# EAGLE design dmpcb2 (EAGLE 9.5.2)
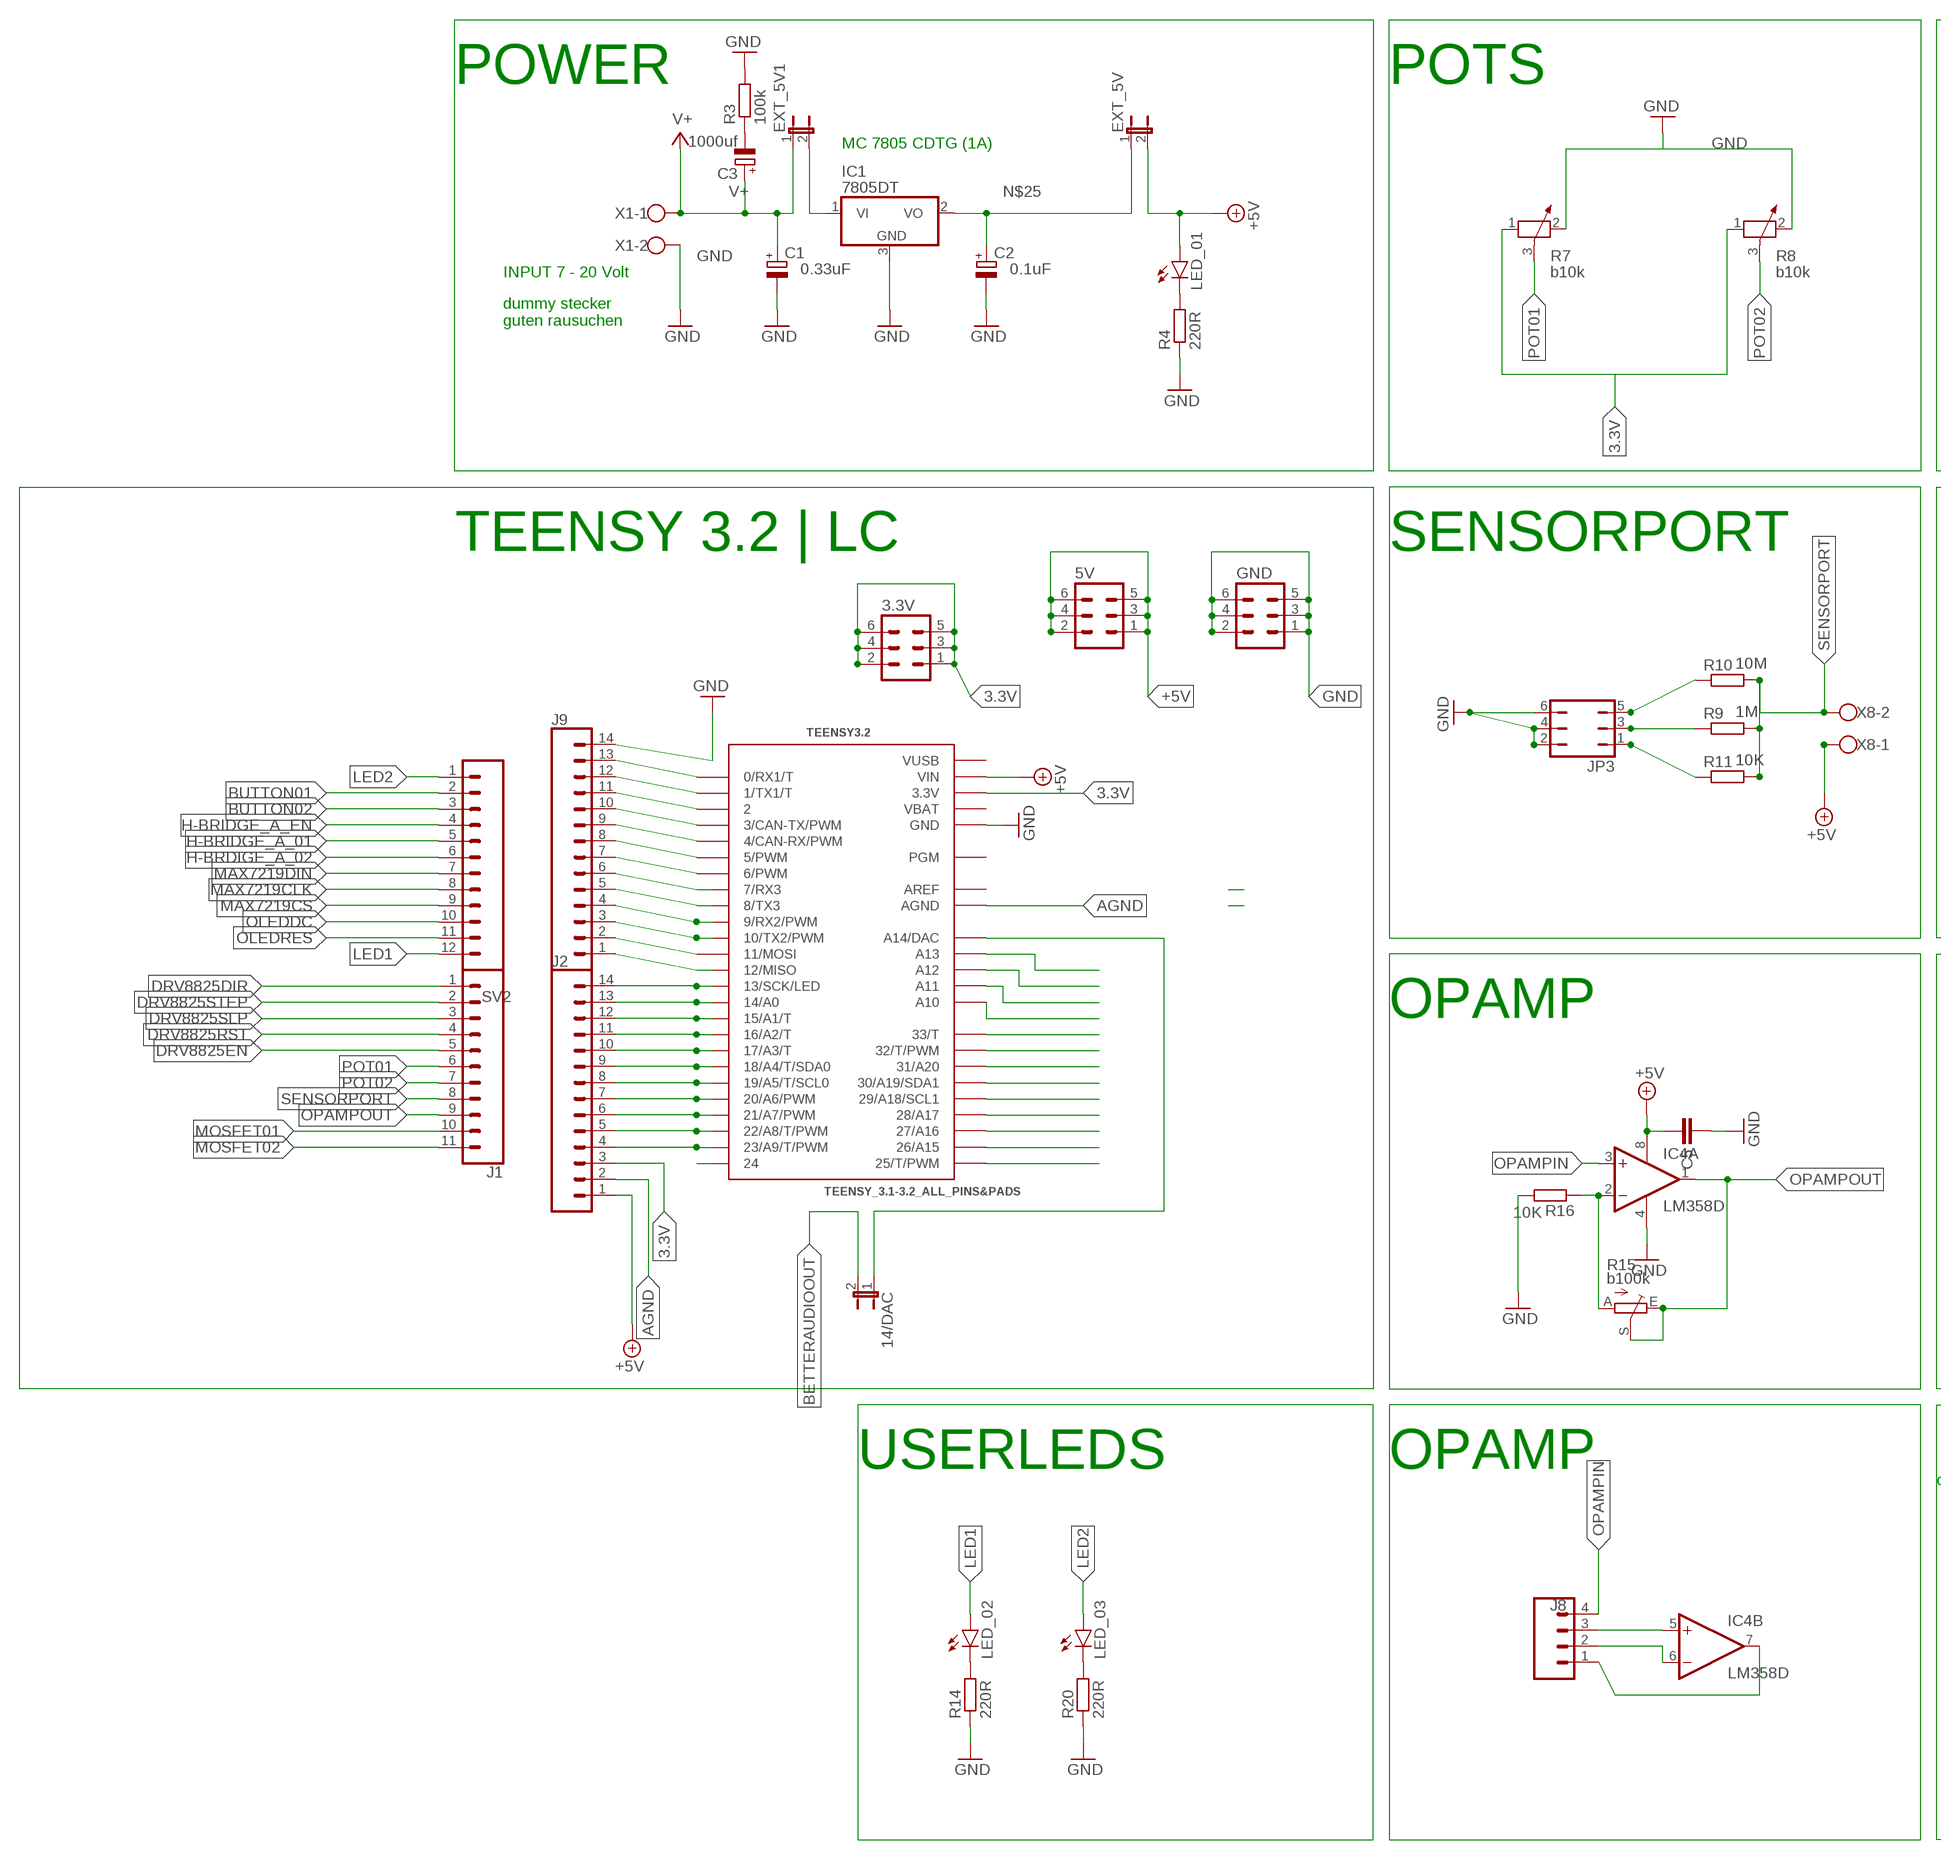
[diagram p0: schematic, sheet 1, part 1 of 2]
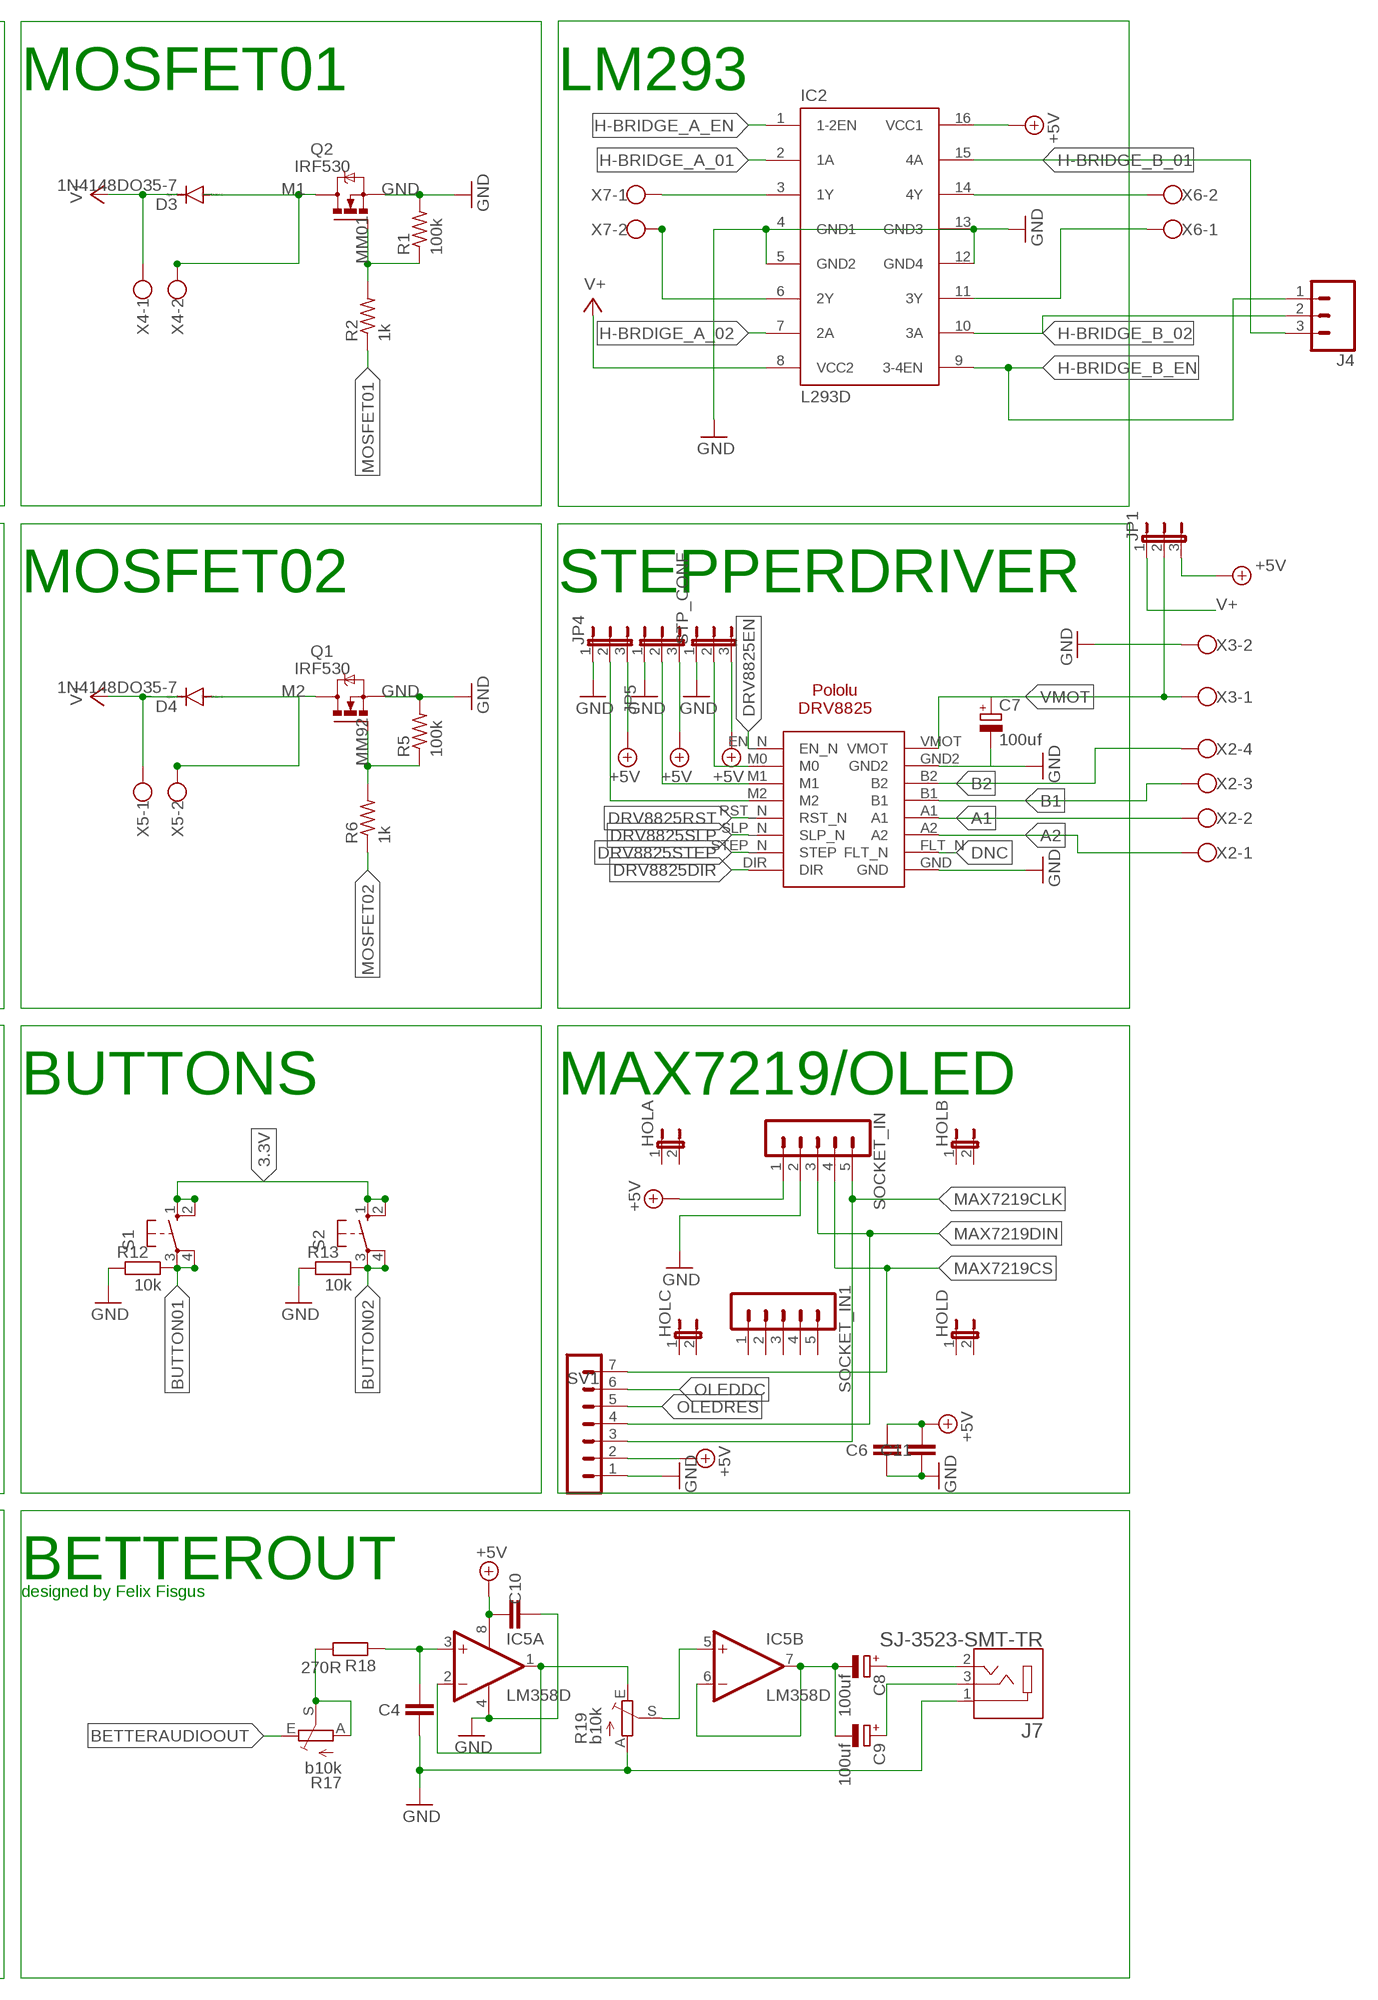
[diagram p1: schematic, sheet 1, part 2 of 2]

## Parts
3.3V  MA03-2  [MA03-2]
5V  MA03-2  [MA03-2]
14/DAC  JP1E  [JP1]
C1  0.33uF  CPOL-EUSANYO_A'  [SANYO-OSCON_A']
C2  0.1uF  CPOL-EUSANYO_A'  [SANYO-OSCON_A']
C3  1000uf  CPOL-EUE3.5-8  [E3,5-8]
C4  100nf  C-EUC0805  [C0805]
C5  100nf  C-EUC0805  [C0805]
C6  100nf  C-EUC0805  [C0805]
C7  100uf  CPOL-EUE5-5  [E5-5]
C8  100uf  CPOL-EUE5-5  [E5-5]
C9  100uf  CPOL-EUE5-5  [E5-5]
C10  100nf  C-EUC0805  [C0805]
C11  10uf  C-EUC0805  [C0805]
D3  1N4148DO35-7  [DO35-7]
D4  1N4148DO35-7  [DO35-7]
DRV8825  POLOLU-DRV8825  [POLOLU-DRV8825]
EXT_5V  JP1E  [JP1]
EXT_5V1  JP1E  [JP1]
GND  MA03-2  [MA03-2]
HOLA  JP1E  [JP1]
HOLB  JP1E  [JP1]
HOLC  JP1E  [JP1]
HOLD  JP1E  [JP1]
IC1  7805DT  [TO252]
IC2  L293D  [DIL16]
IC4  LM358D  [SO08]
IC5  LM358D  [SO08]
J1  CONN_11  [1X11]
J2  CONN_14  [1X14]
J4  CONN_03LOCK_LONGPADS  [1X03_LOCK_LONGPADS]
J7  SJ-3523-SMT-TR  [CUI_SJ-3523-SMT-TR]
J8  CONN_04  [1X04]
J9  CONN_14  [1X14]
JP1  JP2E  [JP2]
JP3  JP3Q  [JP3Q]
JP4  JP2E  [JP2]
JP5  JP2E  [JP2]
LED_01  LEDSML0805  [SML0805]
LED_02  LEDSML0805  [SML0805]
LED_03  LEDSML0805  [SML0805]
Q1  IRF530  [TO220BV]
Q2  IRF530  [TO220BV]
R1  100k  R-US_R0805  [R0805]
R2  1k  R-US_R0805  [R0805]
R3  100k  R-EU_R0805  [R0805]
R4  220R  R-EU_R0805  [R0805]
R5  100k  R-US_R0805  [R0805]
R6  1k  R-US_R0805  [R0805]
R7  b10k  POTENTIOMETER_PT-10  [PT-10]
R8  b10k  POTENTIOMETER_PT-10  [PT-10]
R9  1M  R-EU_M0805  [M0805]
R10  10M  R-EU_M0805  [M0805]
R11  10K  R-EU_M0805  [M0805]
R12  10k  R-EU_M0805  [M0805]
R13  10k  R-EU_M0805  [M0805]
R14  220R  R-EU_R0805  [R0805]
R15  b100k  TRIM_EU-RJ9W  [RJ9W]
R16  10K  R-EU_M0805  [M0805]
R17  b10k  TRIM_EU-RJ9W  [RJ9W]
R18  270R  R-EU_M0805  [M0805]
R19  b10k  TRIM_EU-RJ9W  [RJ9W]
R20  220R  R-EU_R0805  [R0805]
S1  10-XX  [B3F-10XX]
S2  10-XX  [B3F-10XX]
SOCKET_IN  MA05-1  [MA05-1]
SOCKET_IN1  MA05-1  [MA05-1]
STP_CONF  JP2E  [JP2]
SV1  MA07-1  [MA07-1]
SV2  CONN_12  [1X12]
TEENSY3.2  TEENSY_3.1-3.2_ALL_PINS&PADS  [TEENSY_3.0-3.2_ALL_PINS_&_PADS]
X1  W237-102  [W237-102]
X2  W237-4  [W237-4]
X3  W237-102  [W237-102]
X4  W237-102  [W237-102]
X5  W237-102  [W237-102]
X6  W237-102  [W237-102]
X7  W237-102  [W237-102]
X8  W237-102  [W237-102]

## Nets
3.3V: 3.3V.1 3.3V.2 3.3V.3 3.3V.4 3.3V.5 3.3V.6 J2.3 R7.1 R8.1 S1.1(S) S1.2(S1) S2.1(S) S2.2(S1) TEENSY3.2.3.3V TEENSY3.2.3.3V1(3.3V) TEENSY3.2.3.3V2(3.3V)
+5V: 5V.1 5V.2 5V.3 5V.4 5V.5 5V.6 C5.1 C6.1 C10.2 C11.1 EXT_5V.2 IC2.16(VCC1) IC4.8(P:V+) IC5.8(P:V+) J2.1 JP1.3 JP4.3 JP5.3 LED_01.A SOCKET_IN.1 STP_CONF.3 SV1.2 TEENSY3.2.VIN X8.1
A1: DRV8825.A1 X2.2
A2: DRV8825.A2 X2.1
AGND: J2.2 TEENSY3.2.AGND
B1: DRV8825.B1 X2.3
B2: DRV8825.B2 X2.4
BETTERAUDIOOUT: 14/DAC.2 R17.E
BUTTON01: R12.2 S1.3(P) S1.4(P1) SV2.2
BUTTON02: R13.2 S2.3(P) S2.4(P1) SV2.3
DNC: DRV8825.FLT_N
DRV8825DIR: DRV8825.DIR J1.1
DRV8825EN: DRV8825.EN_N J1.5
DRV8825RST: DRV8825.RST_N J1.4
DRV8825SLP: DRV8825.SLP_N J1.3
DRV8825STEP: DRV8825.STEP_N(STEP) J1.2
GND: C1.- C2.- C4.2 C5.2 C6.2 C7.- C10.1 C11.2 DRV8825.GND DRV8825.GND2 GND.1 GND.2 GND.3 GND.4 GND.5 GND.6 IC1.3(GND) IC2.4(GND1) IC2.5(GND2) IC2.12(GND4) IC2.13(GND3) IC4.4(P:V-) IC5.4(P:V-) J7.1 J9.14 JP3.2 JP3.4 JP3.6 JP4.1 JP5.1 Q1.S Q2.S R1.2 R3.2 R4.1 R5.2 R7.2 R8.2 R12.1 R13.1 R14.1 R16.2 R19.A R20.1 SOCKET_IN.2 STP_CONF.1 SV1.1 TEENSY3.2.GND TEENSY3.2.GND1(GND) TEENSY3.2.GND2(GND) X1.2 X3.2
H-BRDIGE_A_02: IC2.7(2A) SV2.6
H-BRIDGE_A_01: IC2.2(1A) SV2.5
H-BRIDGE_A_EN: IC2.1(1-2EN) SV2.4
H-BRIDGE_B_01: IC2.15(4A) J4.3
H-BRIDGE_B_02: IC2.10(3A) J4.2
H-BRIDGE_B_EN: IC2.9(3-4EN) J4.1
LED1: LED_02.A SV2.12
LED2: LED_03.A SV2.1
M1: D3.A Q2.D X4.2
M2: D4.A Q1.D X5.2
MAX7219CLK: SOCKET_IN.5 SV1.3 SV2.8
MAX7219CS: SOCKET_IN.4 SV1.7 SV2.9
MAX7219DIN: SOCKET_IN.3 SV1.4 SV2.7
MM01: Q2.G R1.1 R2.2
MM92: Q1.G R5.1 R6.2
MOSFET01: J1.10 R2.1
MOSFET02: J1.11 R6.1
N$5: IC2.3(1Y) X7.1
N$6: IC2.6(2Y) X7.2
N$8: C3.- R3.1
N$9: LED_01.C R4.2
N$11: IC2.14(4Y) X6.2
N$12: IC2.11(3Y) X6.1
N$16: JP3.5 R10.1
N$17: JP3.3 R9.1
N$18: JP3.1 R11.1
N$19: EXT_5V1.2 IC1.1(VI)
N$20: IC4.5(B:+IN) J8.3
N$22: TEENSY3.2.24
N$23: J2.4 TEENSY3.2.23/A9(23/A9/T/PWM)
N$25: C2.+ EXT_5V.1 IC1.2(VO)
N$26: J2.5 TEENSY3.2.22/A8(22/A8/T/PWM)
N$27: J2.6 TEENSY3.2.21/A7(21/A7/PWM)
N$28: J2.7 TEENSY3.2.20/A6(20/A6/PWM)
N$29: J2.8 TEENSY3.2.19/A5(19/A5/T/SCL0)
N$30: J2.9 TEENSY3.2.18/A4(18/A4/T/SDA0)
N$31: J2.10 TEENSY3.2.17/A3(17/A3/T)
N$32: J2.11 TEENSY3.2.16/A2(16/A2/T)
N$33: J2.12 TEENSY3.2.15/A1(15/A1/T)
N$34: J2.13 TEENSY3.2.14/A0
N$35: J2.14 TEENSY3.2.13(13/SCK/LED)
N$36: J9.1 TEENSY3.2.12(12/MISO)
N$37: J9.2 TEENSY3.2.11(11/MOSI)
N$38: J9.3 TEENSY3.2.10(10/TX2/PWM)
N$39: J9.4 TEENSY3.2.9(9/RX2/PWM)
N$40: J9.5 TEENSY3.2.8(8/TX3)
N$41: J9.6 TEENSY3.2.7(7/RX3)
N$42: TEENSY3.2.25(25/T/PWM)
N$43: TEENSY3.2.26(26/A15)
N$44: TEENSY3.2.27(27/A16)
N$45: TEENSY3.2.28(28/A17)
N$46: TEENSY3.2.29(29/A18/SCL1)
N$47: TEENSY3.2.30(30/A19/SDA1)
N$48: TEENSY3.2.31(31/A20)
N$49: TEENSY3.2.32(32/T/PWM)
N$50: TEENSY3.2.33(33/T)
N$51: TEENSY3.2.A10
N$52: TEENSY3.2.A11
N$53: TEENSY3.2.A12
N$54: TEENSY3.2.A13
N$55: 14/DAC.1 TEENSY3.2.RESET/DAC(A14/DAC)
N$57: DRV8825.M2 JP4.2
N$58: DRV8825.M1 JP5.2
N$59: DRV8825.M0 STP_CONF.2
N$61: J9.12 TEENSY3.2.1(1/TX1/T)
N$62: J9.13 TEENSY3.2.0(0/RX1/T)
N$63: IC4.2(A:-IN) R15.A R16.1
N$64: LED_02.C R14.2
N$66: C8.+ J7.2
N$67: R17.A R17.S R18.2
N$68: C4.1 IC5.3(A:+IN) R18.1
N$69: IC5.1(A:OUT) IC5.2(A:-IN) R19.E
N$70: IC4.6(B:-IN) J8.2
N$71: IC5.5(B:+IN) R19.S
N$72: C8.- C9.- IC5.6(B:-IN) IC5.7(B:OUT)
N$73: C9.+ J7.3
N$75: IC4.7(B:OUT) J8.1
N$76: LED_03.C R20.2
OLEDDC: SV1.6 SV2.10
OLEDRES: SV1.5 SV2.11
OPAMPIN: IC4.3(A:+IN) J8.4
OPAMPOUT: IC4.1(A:OUT) J1.9 R15.E R15.S
PIN2: J9.11 TEENSY3.2.2
PIN3: J9.10 TEENSY3.2.3(3/CAN-TX/PWM)
PIN4: J9.9 TEENSY3.2.4(4/CAN-RX/PWM)
PIN5: J9.8 TEENSY3.2.5(5/PWM)
PIN6: J9.7 TEENSY3.2.6(6/PWM)
POT01: J1.6 R7.3
POT02: J1.7 R8.3
SENSORPORT: J1.8 R9.2 R10.2 R11.2 X8.2
V+: C1.+ C3.+ D3.C D4.C EXT_5V1.1 IC2.8(VCC2) JP1.1 X1.1 X4.1 X5.1
VMOT: C7.+ DRV8825.VMOT JP1.2 X3.1
Unconnected: HOLA.1 HOLA.2 HOLB.1 HOLB.2 HOLC.1 HOLC.2 HOLD.1 HOLD.2 SOCKET_IN1.1 SOCKET_IN1.2 SOCKET_IN1.3 SOCKET_IN1.4 SOCKET_IN1.5 TEENSY3.2.PGM

## Notes on the sheet
- POWER | POTS | MOSFET01 | LM293
- MC 7805 CDTG (1A)
- INPUT 7 - 20 Volt
- dummy stecker
  guten rausuchen
- TEENSY 3.2 | LC | SENSORPORT | MOSFET02 | STEPPERDRIVER
- OPAMP | BUTTONS | MAX7219/OLED
- USERLEDS | OPAMP | BETTEROUT
- designed by Felix Fisgus

## Power pins joined to a net without a drawn wire
AREF: TEENSY3.2.AREF
VBAT: TEENSY3.2.VBAT
VUSB: TEENSY3.2.VUSB

## Library data of the parts
3.3V 5V GND = con-lstb:MA03-2: PIN HEADER; OC_FARNELL: unknown; OC_NEWARK: unknown
14/DAC EXT_5V EXT_5V1 HOLA HOLB HOLC HOLD = jumper:JP1E: JUMPER
C1-C3 C7-C9 = rcl:CPOL-EU: POLARIZED CAPACITOR, European symbol; SPICEPREFIX: C
C4-C6 C10 C11 = rcl:C-EU: CAPACITOR, European symbol; SPICEPREFIX: C
D3 D4 = diode:1N4148: DIODE high speed (Philips)
DRV8825 = alvarop-lib:POLOLU-DRV8825
IC1 = linear:78*: Positive VOLTAGE REGULATOR Source: http://cache.national.com/ds/LM/LM78L05.pdf http://www.fairchildsemi.com/ds/LM/LM7805.pdf
IC2 = st-microelectronics:L293D: PUSH-PULL 4 CHANNEL DRIVER; MPN: L293D; OC_FARNELL: 9589619; OC_NEWARK: 56P8249
IC4 IC5 = linear:LM358: OP AMP also LM158; LM258; LM2904 Source: http://cache.national.com/ds/LM/LM158.pdf
J1 = SparkFun-Connectors:CONN_11: Multi connection point. Often used as Generic Header-pin footprint for 0.1 inch spaced/style header connections On any of the 0.1 inch spaced packages, you can populate with these: Break Away Headers - Straight <https://www.sparkfun.com/products/116> (PRT-00116) Break Away Male Headers - Right Angle <https://www.sparkfun.com/products/553> (PRT-00553) Female Headers <https://www.sparkfun.com/products/115> (PRT-00115) Break Away Headers - Machine Pin <https://www.sparkfun.com/products/117> (PRT-00117) Break Away Female Headers - Swiss Machine Pin <https://www.sparkfun.com/products/743> (PRT-00743) For SCREWTERMINALS and SPRING TERMINALS visit here: Screw Terimnals on SparkFun.com <https://www.sparkfun.com/search/results?term=Screw+Terminals> (5mm/3.5mm/2.54mm spacing) This device is also useful as a general connection point to wire up your design to another part of your project. Our various solder wires solder well into these plated through hole pads. Hook-Up Wire - Assortment (Stranded, 22 AWG) <https://www.sparkfun.com/products/11375> (PRT-11375) Hook-Up Wire - Assortment (Solid Core, 22 AWG) <https://www.sparkfun.com/products/11367> (PRT-11367) View the entire wire category on our website here <https://www.sparkfun.com/categories/141>
J2 J9 = SparkFun-Connectors:CONN_14: Multi connection point. Often used as Generic Header-pin footprint for 0.1 inch spaced/style header connections On any of the 0.1 inch spaced packages, you can populate with these: Break Away Headers - Straight <https://www.sparkfun.com/products/116> (PRT-00116) Break Away Male Headers - Right Angle <https://www.sparkfun.com/products/553> (PRT-00553) Female Headers <https://www.sparkfun.com/products/115> (PRT-00115) Break Away Headers - Machine Pin <https://www.sparkfun.com/products/117> (PRT-00117) Break Away Female Headers - Swiss Machine Pin <https://www.sparkfun.com/products/743> (PRT-00743) For SCREWTERMINALS and SPRING TERMINALS visit here: Screw Terimnals on SparkFun.com <https://www.sparkfun.com/search/results?term=Screw+Terminals> (5mm/3.5mm/2.54mm spacing) This device is also useful as a general connection point to wire up your design to another part of your project. Our various solder wires solder well into these plated through hole pads. Hook-Up Wire - Assortment (Stranded, 22 AWG) <https://www.sparkfun.com/products/11375> (PRT-11375) Hook-Up Wire - Assortment (Solid Core, 22 AWG) <https://www.sparkfun.com/products/11367> (PRT-11367) View the entire wire category on our website here <https://www.sparkfun.com/categories/141> Special notes: Molex polarized connector foot print use with SKU : PRT-08231 with associated crimp pins and housings. 1MM SMD Version SKU: PRT-10208 NOTES ON THE VARIANTS LOCK and LOCK_LONGPADS... This footprint was designed to help hold the alignment of a through-hole component (i.e. 6-pin header) while soldering it into place. You may notice that each hole has been shifted either up or down by 0.005 of an inch from it's more standard position (which is a perfectly straight line). This slight alteration caused the pins (the squares in the middle) to touch the edges of the holes. Because they are alternating, it causes a "brace" to hold the component in place. 0.005 has proven to be the perfect amount of "off-center" position when using our standard breakaway headers. Although looks a little odd when you look at the bare footprint, once you have a header in there, the alteration is very hard to notice. Also,if you push a header all the way into place, it is covered up entirely on the bottom side.
J4 = SparkFun-Connectors:CONN_03: Multi connection point. Often used as Generic Header-pin footprint for 0.1 inch spaced/style header connections On any of the 0.1 inch spaced packages, you can populate with these: Break Away Headers - Straight <https://www.sparkfun.com/products/116> (PRT-00116) Break Away Male Headers - Right Angle <https://www.sparkfun.com/products/553> (PRT-00553) Female Headers <https://www.sparkfun.com/products/115> (PRT-00115) Break Away Headers - Machine Pin <https://www.sparkfun.com/products/117> (PRT-00117) Break Away Female Headers - Swiss Machine Pin <https://www.sparkfun.com/products/743> (PRT-00743) Stackable Header - 3 Pin (Female, 0.1") <https://www.sparkfun.com/products/13875> (PRT-13875) For SCREWTERMINALS and SPRING TERMINALS visit here: Screw Terimnals on SparkFun.com <https://www.sparkfun.com/search/results?term=Screw+Terminals> (5mm/3.5mm/2.54mm spacing) This device is also useful as a general connection point to wire up your design to another part of your project. Our various solder wires solder well into these plated through hole pads. Hook-Up Wire - Assortment (Stranded, 22 AWG) <https://www.sparkfun.com/products/11375> (PRT-11375) Hook-Up Wire - Assortment (Solid Core, 22 AWG) <https://www.sparkfun.com/products/11367> (PRT-11367) View the entire wire category on our website here <https://www.sparkfun.com/categories/141> Special notes: Molex polarized connector foot print use with SKU : PRT-08232 with associated crimp pins and housings.
J7 = SJ-3523-SMT-TR:SJ-3523-SMT-TR: Audio Jack Connector 3.5 mm Low Profile Surface Mount Stereo Jack, 3 Pin Right-Angle; MF: CUI Inc; STANDARD: Manufacturer recommendations
J8 = SparkFun-Connectors:CONN_04: Multi connection point. Often used as Generic Header-pin footprint for 0.1 inch spaced/style header connections On any of the 0.1 inch spaced packages, you can populate with these: Break Away Headers - Straight <https://www.sparkfun.com/products/116> (PRT-00116) Break Away Male Headers - Right Angle <https://www.sparkfun.com/products/553> (PRT-00553) Female Headers <https://www.sparkfun.com/products/115> (PRT-00115) Break Away Headers - Machine Pin <https://www.sparkfun.com/products/117> (PRT-00117) Break Away Female Headers - Swiss Machine Pin <https://www.sparkfun.com/products/743> (PRT-00743) For SCREWTERMINALS and SPRING TERMINALS visit here: Screw Terimnals on SparkFun.com <https://www.sparkfun.com/search/results?term=Screw+Terminals> (5mm/3.5mm/2.54mm spacing) This device is also useful as a general connection point to wire up your design to another part of your project. Our various solder wires solder well into these plated through hole pads. Hook-Up Wire - Assortment (Stranded, 22 AWG) <https://www.sparkfun.com/products/11375> (PRT-11375) Hook-Up Wire - Assortment (Solid Core, 22 AWG) <https://www.sparkfun.com/products/11367> (PRT-11367) View the entire wire category on our website here <https://www.sparkfun.com/categories/141> Special notes: Molex polarized connector foot print use with SKU : PRT-08231 with associated crimp pins and housings. 1MM SMD Version SKU: PRT-10208; PROD_ID: CONN-09696
JP1 JP4 JP5 STP_CONF = jumper:JP2E: JUMPER
JP3 = jumper:JP3Q: JUMPER
LED_01-LED_03 = led:LED: LED OSRAM: - CHIPLED LG R971, LG N971, LY N971, LG Q971, LY Q971, LO R971, LY R971 LH N974, LH R974 LS Q976, LO Q976, LY Q976 LO Q996 - Hyper CHIPLED LW Q18S LB Q993, LB Q99A, LB R99A - SideLED LS A670, LO A670, LY A670, LG A670, LP A670 LB A673, LV A673, LT A673, LW A673 LH A674 LY A675 LS A676, LA A676, LO A676, LY A676, LW A676 LS A679, LY A679, LG A679 - Hyper Micro SIDELED® LS Y876, LA Y876, LO Y876, LY Y876 LT Y87S - SmartLED LW L88C, LW L88S LB L89C, LB L89S, LG L890 LS L89K, LO L89K, LY L89K LS L896, LA L896, LO L896, LY L896 - TOPLED LS T670, LO T670, LY T670, LG T670, LP T670 LSG T670, LSP T670, LSY T670, LOP T670, LYG T670 LG T671, LOG T671, LSG T671 LB T673, LV T673, LT T673, LW T673 LH T674 LS T676, LA T676, LO T676, LY T676, LB T676, LH T676, LSB T676, LW T676 LB T67C, LV T67C, LT T67C, LS T67K, LO T67K, LY T67K, LW E67C LS E67B, LA E67B, LO E67B, LY E67B, LB E67C, LV E67C, LT E67C LW T67C LS T679, LY T679, LG T679 LS T770, LO T770, LY T770, LG T770, LP T770 LB T773, LV T773, LT T773, LW T773 LH T774 LS E675, LA E675, LY E675, LS T675 LS T776, LA T776, LO T776, LY T776, LB T776 LHGB T686 LT T68C, LB T68C - Hyper Mini TOPLED® LB M676 - Mini TOPLED Santana® LG M470 LS M47K, LO M47K, LY M47K Source: http://www.osram.convergy.de LUXEON: - LUMILED® LXK2-PW12-R00, LXK2-PW12-S00, LXK2-PW14-U00, LXK2-PW14-V00 LXK2-PM12-R00, LXK2-PM12-S00, LXK2-PM14-U00 LXK2-PE12-Q00, LXK2-PE12-R00, LXK2-PE12-S00, LXK2-PE14-T00, LXK2-PE14-U00 LXK2-PB12-K00, LXK2-PB12-L00, LXK2-PB12-M00, LXK2-PB14-N00, LXK2-PB14-P00, LXK2-PB14-Q00 LXK2-PR12-L00, LXK2-PR12-M00, LXK2-PR14-Q00, LXK2-PR14-R00 LXK2-PD12-Q00, LXK2-PD12-R00, LXK2-PD12-S00 LXK2-PH12-R00, LXK2-PH12-S00 LXK2-PL12-P00, LXK2-PL12-Q00, LXK2-PL12-R00 Source: www.luxeon.com KINGBRIGHT: KA-3528ASYC Source: www.kingbright.com
Q1 Q2 = transistor-power:IRF530: HEXFET Power MOSFET
R1 R2 R5 R6 = resistor:R-US_: RESISTOR, American symbol
R3 R4 R9-R14 R16 R18 R20 = rcl:R-EU_: RESISTOR, European symbol; SPICEPREFIX: R
R7 R8 = rcl:POTENTIOMETER_: Potentiometer; SPICEMODEL: POT; SPICEPREFIX: X
R15 R17 R19 = pot:TRIM_EU-: POTENTIOMETER
S1 S2 = switch-omron:10-XX: OMRON SWITCH; MPN: B3F-1000; OC_FARNELL: 176432; OC_NEWARK: 36M3542
SOCKET_IN SOCKET_IN1 = con-lstb:MA05-1: PIN HEADER; OC_FARNELL: unknown; OC_NEWARK: unknown
SV1 = con-lstb:MA07-1: PIN HEADER; OC_FARNELL: unknown; OC_NEWARK: unknown
SV2 = SparkFun-Connectors:CONN_12: Multi connection point. Often used as Generic Header-pin footprint for 0.1 inch spaced/style header connections On any of the 0.1 inch spaced packages, you can populate with these: Break Away Headers - Straight <https://www.sparkfun.com/products/116> (PRT-00116) Break Away Male Headers - Right Angle <https://www.sparkfun.com/products/553> (PRT-00553) Female Headers <https://www.sparkfun.com/products/115> (PRT-00115) Break Away Headers - Machine Pin <https://www.sparkfun.com/products/117> (PRT-00117) Break Away Female Headers - Swiss Machine Pin <https://www.sparkfun.com/products/743> (PRT-00743) For SCREWTERMINALS and SPRING TERMINALS visit here: Screw Terimnals on SparkFun.com <https://www.sparkfun.com/search/results?term=Screw+Terminals> (5mm/3.5mm/2.54mm spacing) This device is also useful as a general connection point to wire up your design to another part of your project. Our various solder wires solder well into these plated through hole pads. Hook-Up Wire - Assortment (Stranded, 22 AWG) <https://www.sparkfun.com/products/11375> (PRT-11375) Hook-Up Wire - Assortment (Solid Core, 22 AWG) <https://www.sparkfun.com/products/11367> (PRT-11367) View the entire wire category on our website here <https://www.sparkfun.com/categories/141> Special notes: Molex polarized connector foot print use with SKU : PRT-08231 with associated crimp pins and housings. 1MM SMD Version SKU: PRT-10208 NOTES ON THE VARIANTS LOCK and LOCK_LONGPADS... This footprint was designed to help hold the alignment of a through-hole component (i.e. 6-pin header) while soldering it into place. You may notice that each hole has been shifted either up or down by 0.005 of an inch from it's more standard position (which is a perfectly straight line). This slight alteration caused the pins (the squares in the middle) to touch the edges of the holes. Because they are alternating, it causes a "brace" to hold the component in place. 0.005 has proven to be the perfect amount of "off-center" position when using our standard breakaway headers. Although looks a little odd when you look at the bare footprint, once you have a header in there, the alteration is very hard to notice. Also,if you push a header all the way into place, it is covered up entirely on the bottom side.
TEENSY3.2 = Teensy_3_and_LC_Series_Boards_v1.4:TEENSY_3.1-3.2_ALL_PINS&PADS: Footprint for Teensy 3.1 or 3.2 board using all pads and all through-holes. Pads need a 2x7 0.1" SMD header.
X1 X3-X8 = con-wago-500:W237-102: WAGO SCREW CLAMP; MPN: 237-102; OC_FARNELL: unknown; OC_NEWARK: 70K9898
X2 = con-wago-500:W237-4: WAGO SCREW CLAMP; OC_FARNELL: unknown; OC_NEWARK: unknown

## Board
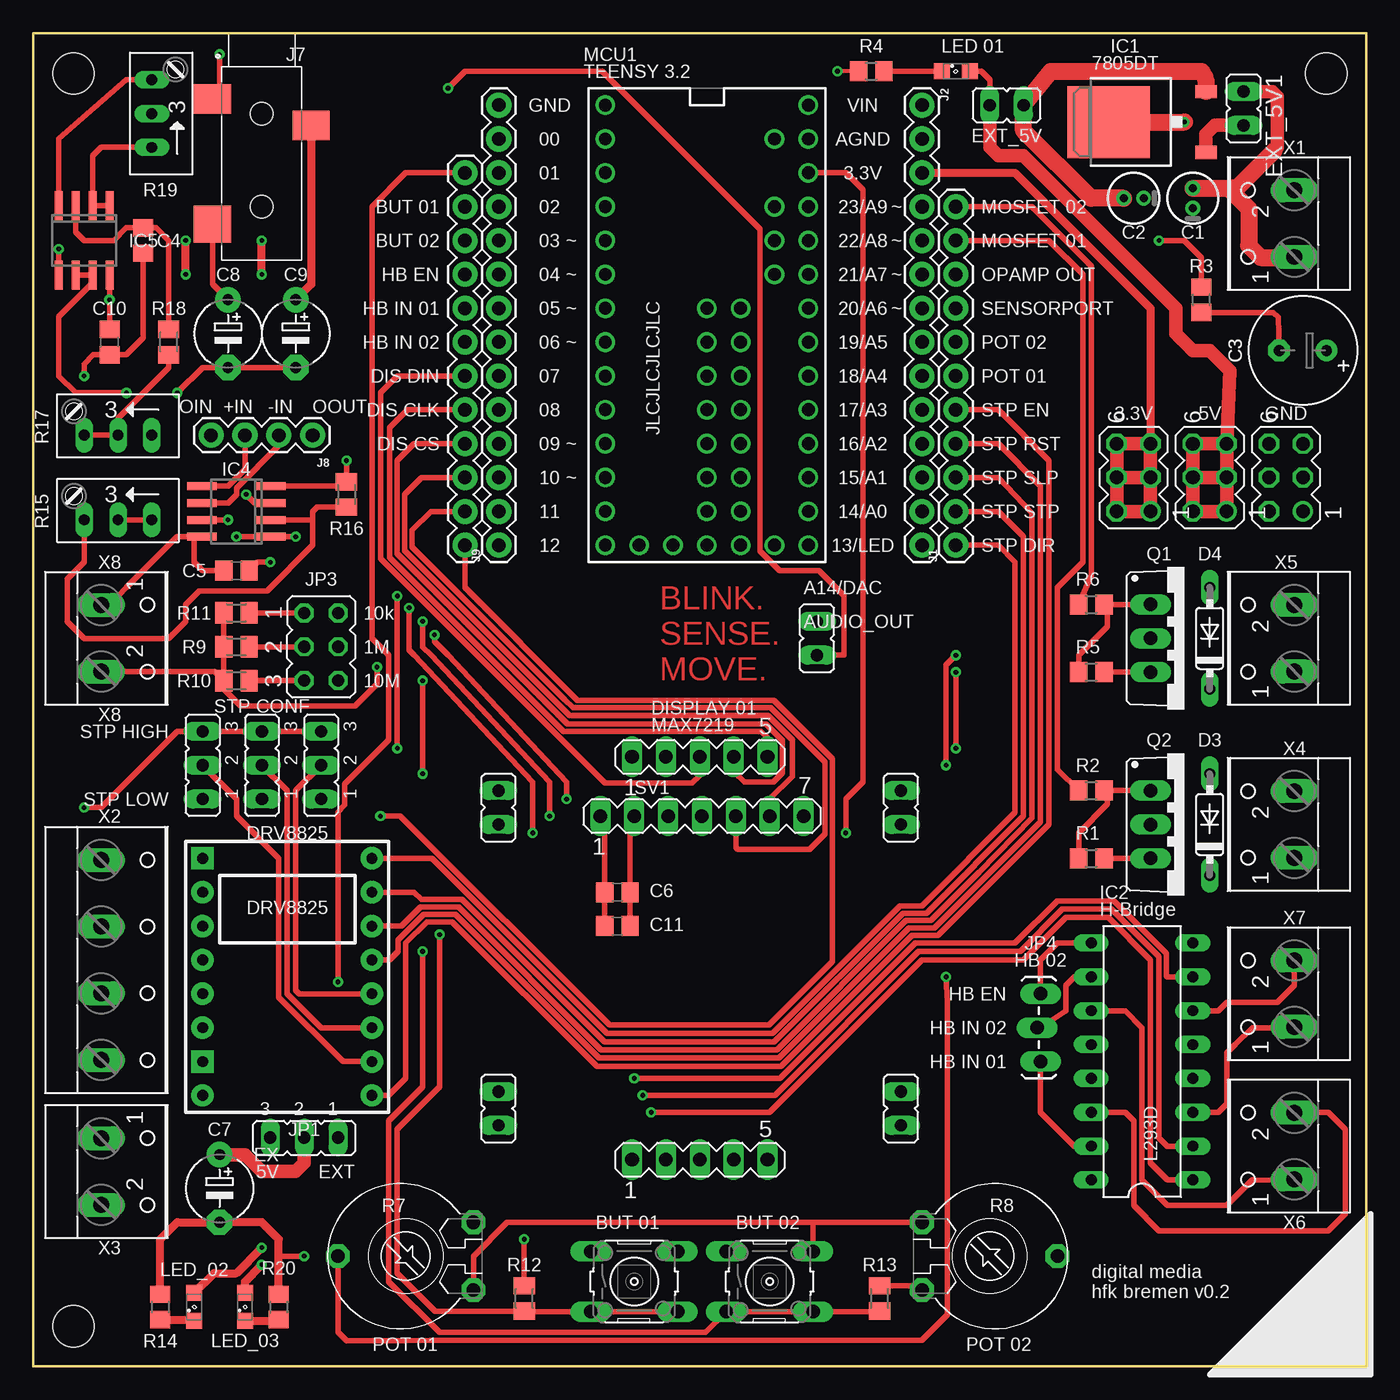
[diagram p2: board, top side]
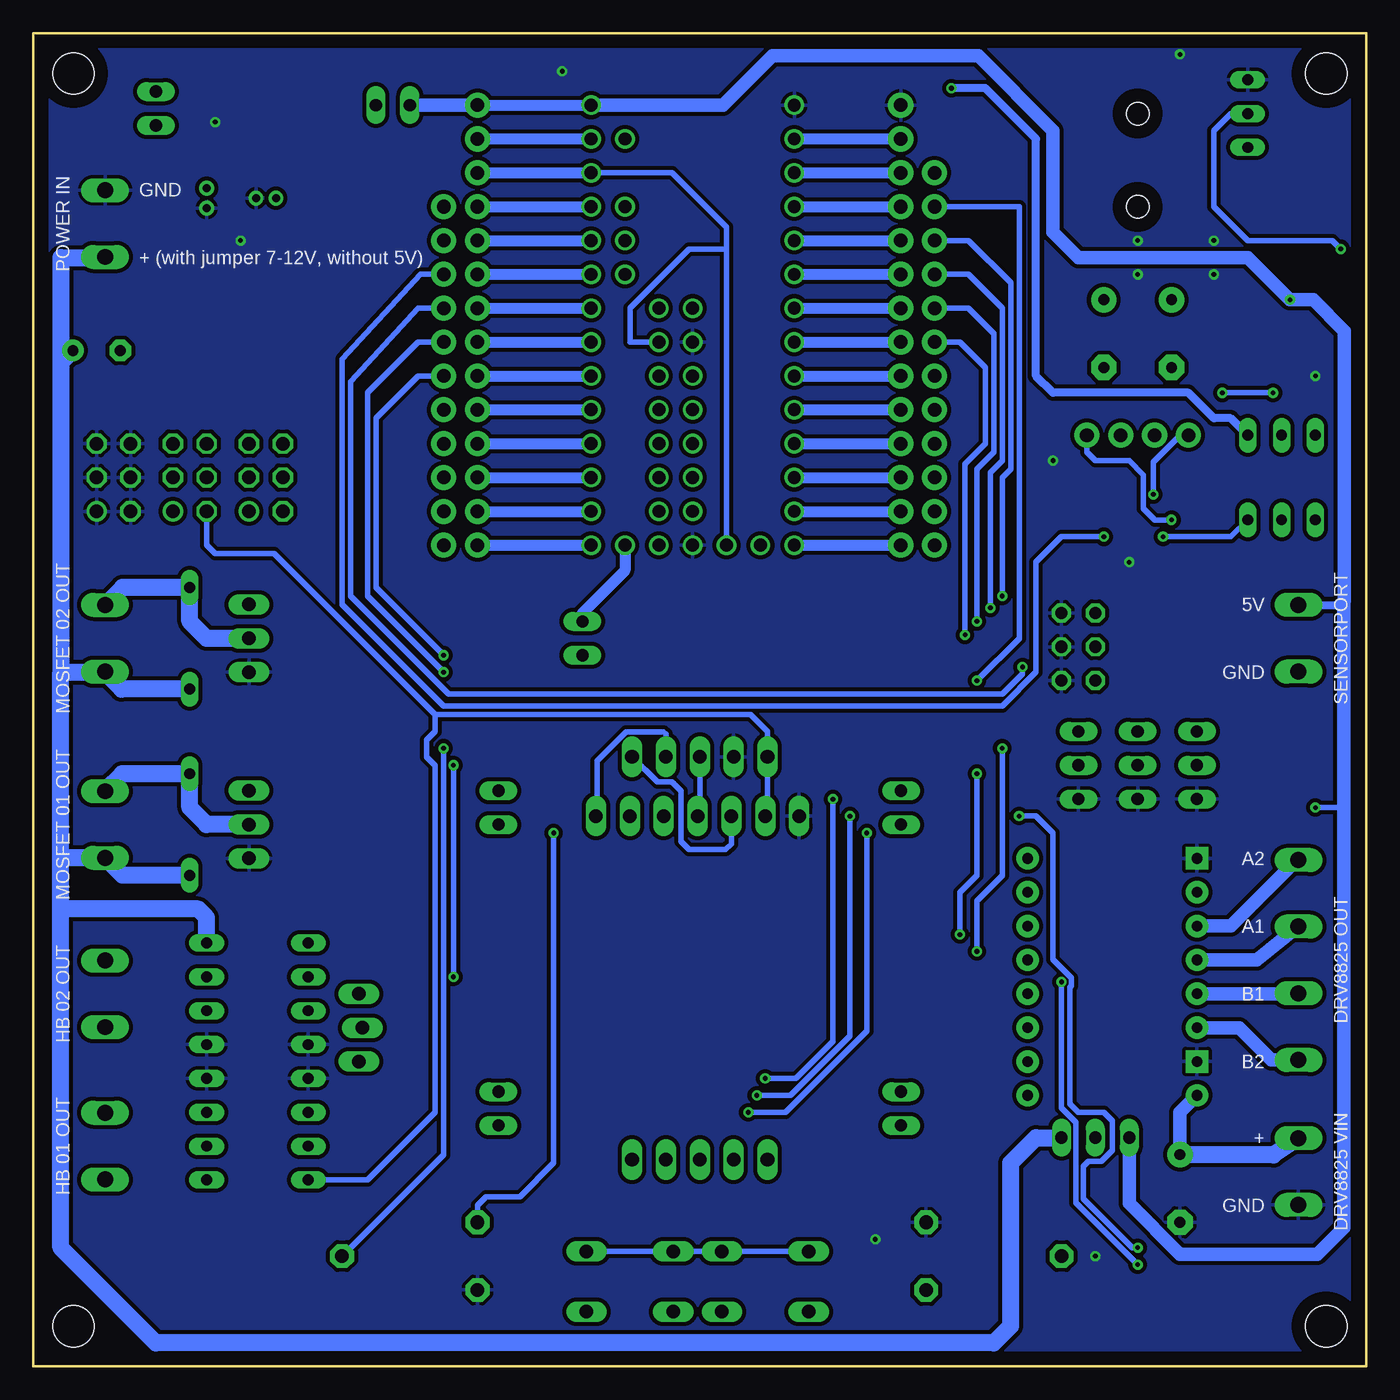
[diagram p3: board, bottom side, seen from below]

Size 100 x 100 mm. Coordinates in mm from the lower left corner, seen from the top.
Outline: 100,100 100,0 0,0 0,100 100,100
Copper layers (1*16): Top 0.035mm / dielectric 1.5mm / Bottom 0.035mm
Design rules "default": minimum track width 6mil, minimum drill 0.35mm, track to track 6mil, track to pad 6mil, pad to pad 6mil, via to via 6mil, smd to smd 6mil, copper to edge 40mil, drill to drill 6mil, minimum pad ring 10mil, minimum via ring 8mil, stop-mask expansion 4mil, vias tented up to drill 0mil, thermal gap 10mil
Holes 3.1 mm at 97,3 3,97 3,3 97,97

### Footprints (pad centres in the part's own frame; a part is rotated, then mirrored left to right if it is on the bottom)
MA03-2 = drill 1.016: 1 -2.54,-1.27 | drill 1.016 octagon: 2 -2.54,1.27; 3 0,-1.27; 4 0,1.27; 5 2.54,-1.27; 6 2.54,1.27
JP1 = drill 0.914 long: 1 0,-1.27; 2 0,1.27
SANYO-OSCON_A' = drill 0.6 pad 1: + 0.75,0; - -0.75,0
E3,5-8 = drill 0.813 pad 1.6: + -1.778,0 | drill 0.813 pad 1.6 octagon: - 1.778,0
C0805 = smd 1.3 x 1.5: 1 -0.95,0; 2 0.95,0
E5-5 = drill 0.813 pad 1.905: + -2.54,0 | drill 0.813 pad 1.905 octagon: - 2.54,0
DO35-7 = drill 0.813 long: A 3.81,0; C -3.81,0
POLOLU-DRV8825 = drill 0.8 pad 1.676: A1 6.35,-1.27; A2 6.35,-3.81; B1 6.35,1.27; B2 6.35,3.81; DIR -6.35,-8.89; EN_N -6.35,8.89; FLT_N 6.35,-6.35; M0 -6.35,6.35; M1 -6.35,3.81; M2 -6.35,1.27; RST_N -6.35,-1.27; SLP_N -6.35,-3.81; STEP_N -6.35,-6.35; VMOT 6.35,8.89 | drill 0.8 pad 1.676 square: GND 6.35,-8.89; GND2 6.35,6.35
TO252 = smd 1 x 1.6: 1 -2.28,-4.8; 2 2.28,-4.8 | smd 5.4 x 6.2: 3 0,2.5
DIL16 = drill 0.813 long: 1 -8.89,-3.81; 2 -6.35,-3.81; 3 -3.81,-3.81; 4 -1.27,-3.81; 5 1.27,-3.81; 6 3.81,-3.81; 7 6.35,-3.81; 8 8.89,-3.81; 9 8.89,3.81; 10 6.35,3.81; 11 3.81,3.81; 12 1.27,3.81; 13 -1.27,3.81; 14 -3.81,3.81; 15 -6.35,3.81; 16 -8.89,3.81
SO08 = smd 0.6 x 2.2: 1 -1.905,-2.6; 2 -0.635,-2.6; 3 0.635,-2.6; 4 1.905,-2.6; 5 1.905,2.6; 6 0.635,2.6; 7 -0.635,2.6; 8 -1.905,2.6
1X11 = drill 1.016 pad 1.88: 1 0,0; 2 2.54,0; 3 5.08,0; 4 7.62,0; 5 10.16,0; 6 12.7,0; 7 15.24,0; 8 17.78,0; 9 20.32,0; 10 22.86,0; 11 25.4,0
1X14 = drill 1.016 pad 1.88: 1 0,0; 2 2.54,0; 3 5.08,0; 4 7.62,0; 5 10.16,0; 6 12.7,0; 7 15.24,0; 8 17.78,0; 9 20.32,0; 10 22.86,0; 11 25.4,0; 12 27.94,0; 13 30.48,0; 14 33.02,0
1X03_LOCK_LONGPADS = drill 1.016 long: 1 0,0; 2 2.54,-0.254; 3 5.08,0
CUI_SJ-3523-SMT-TR = smd 2.2 x 2.8: 1 -1.1,-3.7; 3 0.9,3.7 | smd 2.8 x 2.8: 2 8.3,-3.7 | hole 1.7: 0,0; 7,0
1X04 = drill 1.016 pad 1.88: 1 0,0; 2 2.54,0; 3 5.08,0; 4 7.62,0
JP2 = drill 0.914 long: 1 -2.54,0; 2 0,0; 3 2.54,0
JP3Q = drill 0.914 octagon: 1 -2.54,-1.27; 2 -2.54,1.27; 3 0,-1.27; 4 0,1.27; 5 2.54,-1.27; 6 2.54,1.27
SML0805 = smd 1.2 x 1.2: A 1.05,0; C -1.05,0
TO220BV = drill 1.016 long: D 0,-2.54; G -2.54,-2.54; S 2.54,-2.54
R0805 = smd 1.3 x 1.5: 1 -0.95,0; 2 0.95,0
PT-10 = drill 1.016 pad 1.778 octagon: 1 -2.54,-5.08; 2 2.54,-5.08; 3 0,5.08
M0805 = smd 1.3 x 1.6: 1 -0.95,0; 2 0.95,0
RJ9W = drill 0.813 long: A 2.54,0.635; E -2.54,0.635; S 0,0.635
B3F-10XX = drill 1.016 long: 1 -3.251,2.261; 2 3.251,2.261; 3 -3.251,-2.261; 4 3.251,-2.261
MA05-1 = drill 1.016 long: 1 -5.08,0; 2 -2.54,0; 3 0,0; 4 2.54,0; 5 5.08,0
MA07-1 = drill 1.016 long: 1 -7.62,0; 2 -5.08,0; 3 -2.54,0; 4 0,0; 5 2.54,0; 6 5.08,0; 7 7.62,0
1X12 = drill 1.016 pad 1.88: 1 0,0; 2 2.54,0; 3 5.08,0; 4 7.62,0; 5 10.16,0; 6 12.7,0; 7 15.24,0; 8 17.78,0; 9 20.32,0; 10 22.86,0; 11 25.4,0; 12 27.94,0
TEENSY_3.0-3.2_ALL_PINS_&_PADS = drill 0.965: 0 -7.62,13.97; 1 -7.62,11.43; 2 -7.62,8.89; 3 -7.62,6.35; 3.3V 7.62,11.43; 3.3V1 -2.54,-16.51; 3.3V2 2.54,-1.27; 4 -7.62,3.81; 5 -7.62,1.27; 6 -7.62,-1.27; 7 -7.62,-3.81; 8 -7.62,-6.35; 9 -7.62,-8.89; 10 -7.62,-11.43; 11 -7.62,-13.97; 12 -7.62,-16.51; 13 7.62,-16.51; 14/A0 7.62,-13.97; 15/A1 7.62,-11.43; 16/A2 7.62,-8.89; 17/A3 7.62,-6.35; 18/A4 7.62,-3.81; 19/A5 7.62,-1.27; 20/A6 7.62,1.27; 21/A7 7.62,3.81; 22/A8 7.62,6.35; 23/A9 7.62,8.89; 24 0,-3.81; 25 0,-6.35; 26 0,-8.89; 27 0,-11.43; 28 0,-13.97; 29 2.54,-13.97; 30 2.54,-11.43; 31 2.54,-8.89; 32 2.54,-6.35; 33 2.54,-3.81; A10 5.08,6.35; A11 5.08,3.81; A12 0,1.27; A13 2.54,1.27; AGND 7.62,13.97; AREF 5.08,8.89; GND -7.62,16.51; GND1 0,-16.51; GND2 0,-1.27; PGM 2.54,-16.51; RESET/DAC 5.08,-16.51; VBAT -5.08,-16.51; VIN 7.62,16.51; VUSB 5.08,13.97
W237-102 = drill 1.194 long: 1 -2.5,-1.27; 2 2.5,-1.27
W237-4 = drill 1.194 long: 1 -7.5,-1.27; 2 -2.5,-1.27; 3 2.5,-1.27; 4 7.5,-1.27

### Placement (x,y rotation side)
3.3V  82.55,66.67 90 top
5V  88.27,66.67 90 top
14/DAC  58.8,54.61 180 top
C1  87,87.63 90 top
C2  82.55,87.63 180 top
C3  95.25,76.2 180 top
C4  8.26,84.45 270 top
C5  15.24,59.69 0 top
C6  43.81,35.56 180 top
C7  13.97,13.34 270 top
C8  14.61,77.47 270 top
C9  19.68,77.47 270 top
C10  5.71,76.83 90 top
C11  43.81,33.02 180 top
D3  88.27,40.64 90 top
D4  88.27,54.61 90 top
DRV8825  19.05,29.21 180 top
EXT_5V  73.03,94.61 90 top
EXT_5V1  90.81,94.36 180 top
GND  93.98,66.67 90 top
HOLA  34.9,19.33 180 top
HOLB  34.9,41.91 180 top
HOLC  65.1,41.91 180 top
HOLD  65.1,19.33 180 top
IC1  83.19,93.34 90 top
IC2  83.19,22.86 90 top
IC4  15.24,64.14 90 top
IC5  3.81,84.45 180 top
J1  69.22,61.59 90 top
J2  66.67,94.61 270 top
J4  75.56,27.94 270 top
J7  17.14,93.98 270 top
J8  20.95,69.85 180 top
J9  34.92,61.59 90 top
JP1  20.32,17.14 180 top
JP3  21.59,53.98 270 top
JP4  21.59,45.09 90 top
JP5  17.14,45.09 90 top
LED_01  69.22,97.16 0 top
LED_02  12.06,4.45 90 top
LED_03  15.88,4.45 90 top
Q1  86.36,54.61 270 top
Q2  86.36,40.64 270 top
R1  79.38,38.1 0 top
R2  79.38,43.18 0 top
R3  87.63,80.01 90 top
R4  62.87,97.16 0 top
R5  79.38,52.07 0 top
R6  79.38,57.15 0 top
R7  27.94,8.26 90 top
R8  71.75,8.26 270 top
R9  15.24,53.98 180 top
R10  15.24,51.44 180 top
R11  15.24,56.52 180 top
R12  36.83,5.08 270 top
R13  63.5,5.08 270 top
R14  9.53,4.45 270 top
R15  6.35,64.14 180 top
R16  23.5,65.41 90 top
R17  6.35,70.48 180 top
R18  10.16,76.83 270 top
R19  9.53,93.98 90 top
R20  18.41,4.45 270 top
S1  45.09,6.35 0 top
S2  55.24,6.35 0 top
SOCKET_IN  50,45.72 0 top
SOCKET_IN1  50,15.49 0 top
STP_CONF  12.7,45.09 90 top
SV1  50.16,41.27 0 top
SV2  32.38,89.53 270 top
TEENSY3.2  50.53,78.11 0 top
X1  93.34,85.72 90 top
X2  6.35,30.48 270 top
X3  6.35,14.61 270 top
X4  93.34,40.64 90 top
X5  93.34,54.61 90 top
X6  93.34,16.51 90 top
X7  93.34,27.94 90 top
X8  6.35,54.61 270 top

### Tracks (layer width: path | path; a pad name or v marks a point on that pad's centre or on a via)
3.3V  (via drill 0.35)
  Top 0.406: R7.1 33.02,8.26 35.56,10.79 58.42,10.79 | 58.42,10.79 R8.1 | v60.96,40.01 60.96,42.55 62.23,43.81 62.23,88.27 60.96,89.53 TEENSY3.2.3.3V | S2.2 58.5,10.72 58.42,10.79
  Top 0.61: J2.3 73.66,89.53 83.82,79.38 3.3V.5
  Top 1.016: 3.3V.3 3.3V.5 3.3V.6 3.3V.2 3.3V.1 3.3V.3 | 3.3V.4 3.3V.3
  Bottom 0.406: TEENSY3.2.3.3V1 47.99,83.82 | 47.99,83.82 47.99,85.45 52.07,89.53 TEENSY3.2.3.3V | TEENSY3.2.3.3V2 55.24,76.83 55.24,79.38 50.8,83.82 47.99,83.82 | S1.1 S1.2 S2.1 S2.2 | R8.1 66.67,12.06 66.04,12.7 63.5,12.7 60.96,15.24 v60.96,40.01
  Bottom 0.813: J2.3 TEENSY3.2.3.3V
+5V  (via drill 0.35)
  Top 0.406: IC5.8 v5.71,80.01 C10.2 | JP4.3 JP5.3 STP_CONF.3 10.79,47.62 5.08,41.91 v3.81,41.91 | X8.1 5.75,57.15 6.99,58.42 10.79,62.23 12.06,62.23 | 12.06,62.23 IC4.8 | EXT_5V.2 71.75,96.52 71.12,97.16 LED_01.A | C5.1 12.7,59.69 12.06,60.33 12.06,62.23 | SV1.2 44.77,40.95 C6.1 C11.1
  Top 1.016: 5V.5 89.76,74.68 89.76,74.71 88.27,76.2 87,76.2 85.72,77.47 85.72,79.38 74.3,90.81 72.39,90.81 71.75,91.44 EXT_5V.2 | 5V.5 5V.3 | 5V.3 5V.1 5V.2 5V.4 | 5V.5 5V.6 5V.4 | 5V.4 5V.3
  Bottom 0.406: SOCKET_IN.1 44.92,47.62 | 44.92,47.62 46.19,48.9 69.85,48.9 | 69.85,48.9 81.92,60.96 86.36,60.96 87,61.59 5V.2 | IC2.16 74.93,13.97 69.85,19.05 69.85,45.09 70.48,45.72 70.48,46.99 69.85,47.62 69.85,48.9 | v3.81,41.91 1.68,41.91 | SOCKET_IN.1 44.92,41.44 SV1.2 | SOCKET_IN.1 44.92,47.62 | SOCKET_IN.1 44.92,47.62
  Bottom 0.61: 1.68,57.11 1.91,57.11 X8.1
  Bottom 0.813: J2.1 TEENSY3.2.VIN
  Bottom 1.016: J2.1 EXT_5V.2 | TEENSY3.2.VIN 48.26,94.61 44.55,98.32 29.11,98.32 23.5,92.71 23.5,85.09 21.59,83.19 8.89,83.19 v5.71,80.01 3.96,80.01 1.63,77.67 1.63,57.39 1.91,57.11 | JP1.3 17.78,12.22 13.97,8.41 3.66,8.41 1.68,10.39 1.68,41.91 1.68,57.11
A1
  Bottom 1.016: X2.2 8.21,30.48 DRV8825.A1
A2
  Bottom 1.016: X2.1 5.71,37.47 10.16,33.02 DRV8825.A2
AGND
  Bottom 0.813: J2.2 TEENSY3.2.AGND
B1
  Bottom 1.016: DRV8825.B1 5.75,27.94 X2.3
B2
  Bottom 1.016: DRV8825.B2 9.53,25.4 7.11,22.98 X2.4
BETTERAUDIOOUT  (via drill 0.35)
  Top 0.406: 14/DAC.2 60.83,53.34 60.83,57.81 58.96,59.69 55.98,59.69 54.52,61.14 54.52,85.31 42.67,97.16 35.81,97.16 32.38,97.16 v31.11,95.89
  Bottom 0.61: R17.E 10.16,71.12 11.43,71.12 13.34,73.03 23.5,73.03 24.77,74.3 24.77,92.08 28.57,95.89 v31.11,95.89
BUTTON01  (via drill 0.35)
  Top 0.406: S1.4 S1.3 36.87,4.09 R12.2 30.16,4.13 27.3,6.99 27.3,17.78 30.48,20.95 v30.48,32.38 | v29.21,44.45 v29.21,51.44
  Bottom 0.406: v30.48,32.38 30.48,35.56 29.21,36.83 v29.21,44.45 | v29.21,51.44 26.04,54.61 26.04,87 SV2.2
BUTTON02  (via drill 0.35)
  Top 0.406: R13.2 63.46,4.09 S2.4 S2.3 50.44,2.54 30.48,2.54 26.67,6.35 26.67,18.41 29.21,20.95 v29.21,31.11 | v27.3,46.35 v27.3,57.78
  Bottom 0.406: v29.21,31.11 29.21,34.92 27.3,36.83 v27.3,46.35 | SV2.3 29.84,84.45 26.67,81.28 26.67,67.31 27.3,66.67 v27.3,57.78
DRV8825DIR
  Top 0.406: J1.1 72.39,61.59 73.66,60.33 73.66,41.53 66.67,34.54 65.01,34.54 55.45,24.98 43.03,24.98 29.91,38.1 DRV8825.DIR
DRV8825EN
  Top 0.406: J1.5 72.39,71.75 76.2,67.94 76.2,40.64 67.87,32.31 65.94,32.31 56.11,22.48 42.29,22.48 31.43,33.34 29.53,33.34 27.94,31.75 27.94,21.59 26.67,20.32 DRV8825.EN_N
DRV8825RST
  Top 0.406: J1.4 72.39,69.22 75.56,66.04 75.56,40.83 67.6,32.87 65.7,32.87 55.95,23.11 42.45,23.11 31.66,33.9 29.3,33.9 27.38,31.98 27.38,31.11 26.75,30.48 DRV8825.RST_N
DRV8825SLP
  Top 0.406: J1.3 72.39,66.67 74.93,64.01 74.93,41.12 70.99,37.08 67.33,33.43 65.47,33.43 55.8,23.75 42.6,23.75 31.89,34.45 29.07,34.45 27.63,33.02 DRV8825.SLP_N
DRV8825STEP
  Top 0.406: J1.2 72.39,64.14 74.3,62.23 74.3,41.27 67,33.98 65.24,33.98 55.58,24.32 43.18,24.32 42.99,24.32 42.86,24.32 32.17,35.01 29.12,35.01 28.57,35.56 DRV8825.STEP_N
GND  (via drill 0.35)
  Top 0.305: R4.1 v60.33,97.16
  Top 0.406: J7.1 13.97,95.61 v13.97,98.42 | R5.2 Q1.S | R1.2 Q2.S | IC5.4 1.91,92.08 6.99,96.52 R19.A | C4.2 8.26,77.16 6.99,75.89 C10.1 4.51,75.89 3.81,75.18 v3.81,74.3 | IC4.4 23.18,66.04 R16.2 v23.5,67.94 | R13.1 66.36,6.03 R8.2 | R12.1 v36.83,9.53 | v84.45,84.45 86.36,84.45 87.63,83.19 R3.2 | C5.2 16.82,60.33 v17.78,60.33 | C11.2 C6.2 42.87,40.95 SV1.1 | 18.41,8.26 v20.32,8.26
  Top 0.61: v17.14,81.92 v17.14,84.45 | v11.43,81.92 v11.43,84.45 | R14.1 9.53,9.53 10.79,10.79 C7.- 17.14,10.79 18.41,9.53 18.41,8.26 R20.1
  Top 1.27: IC1.3 v86.36,93.34
  pour Bottom (isolate 0.305): 101.6,-1.91 -4.45,-1.91 -4.45,101.6 101.6,101.6
H-BRDIGE_A_02  (via drill 0.35)
  Top 0.406: v40.01,42.55 40.01,43.81 31.11,53.34 30.1,54.36 v30.1,54.86 | v45.09,21.59 56.01,21.59 66.17,31.75 73.66,31.75 76.83,34.92 81.05,34.92 85.01,30.96 85.01,29.29 85.09,29.21 IC2.7
  Bottom 0.406: v40.01,42.55 40.01,24.38 42.8,21.59 v45.09,21.59 | SV2.6 30.48,76.83 28.57,74.93 28.57,69.22 29.84,67.94 30.1,67.69 v30.1,54.86
H-BRIDGE_A_01  (via drill 0.35)
  Top 0.406: IC2.2 85.09,16.51 84.45,17.14 84.45,30.73 80.9,34.29 77.22,34.29 74.04,31.11 66.42,31.11 55.63,20.32 v45.72,20.32 | v38.73,41.27 38.73,43.81 29.84,53.34 29.21,53.98 v29.21,55.88
  Bottom 0.406: v38.73,41.27 38.73,24.77 43.18,20.32 v45.72,20.32 | SV2.5 29.84,79.38 27.94,77.47 27.94,68.58 29.21,67.31 v29.21,55.88
H-BRIDGE_A_EN  (via drill 0.35)
  Top 0.406: IC2.1 85.09,13.97 83.82,15.24 83.82,30.48 80.64,33.66 77.47,33.66 74.3,30.48 66.67,30.48 55.24,19.05 v46.35,19.05 | v37.47,40.01 37.47,43.81 28.57,53.34 28.19,53.72 v28.19,56.9
  Bottom 0.406: v37.47,40.01 37.47,25.15 43.56,19.05 v46.35,19.05 | SV2.4 29.84,81.92 27.3,79.38 27.3,67.94 27.94,67.31 28.19,67.06 v28.19,56.9
H-BRIDGE_B_01
  Top 0.406: J4.3 75.56,19.05 78.11,16.51 IC2.15
H-BRIDGE_B_02
  Top 0.406: J4.2 75.56,25.4 77.47,26.67 77.47,28.57 78.11,29.21 IC2.10
H-BRIDGE_B_EN
  Top 0.406: J4.1 75.56,30.48 76.83,31.75 IC2.9
LED1  (via drill 0.35)
  Top 0.406: SV2.12 32.38,58.42 40.84,49.96 55.55,49.96 59.97,45.55 59.97,31.75 59.97,31.43 59.97,30.37 59.88,30.29 55.18,25.59 43.21,25.59 27.53,41.27 v26.04,41.27
  Top 0.61: LED_02.A 13.55,6.99 15.24,6.99 v17.14,8.89
  Bottom 0.406: v17.14,8.89 17.53,8.89 21.21,12.57 21.21,14.99 20.83,15.37 19.88,15.37 19.05,16.2 19.05,18.41 19.68,19.05 21.59,19.05 22.23,19.68 22.23,28.43 22.13,28.52 22.13,29.13 23.5,30.5 23.5,40.01 24.77,41.27 v26.04,41.27
LED2  (via drill 0.35)
  Top 0.406: SV2.1 27.94,89.53 25.4,87 25.4,54.61 26.67,53.34 26.67,46.99 23.37,43.69 23.37,42.1 22.86,41.59 v22.86,28.83
  Top 0.61: LED_03.A 15.88,6.35 v17.14,7.62
  Bottom 0.406: v22.86,28.83 22.86,19.36 21.79,18.3 21.79,12.27 v17.14,7.62
M1
  Bottom 0.152: 94.61,43.18 X4.2
  Bottom 1.27: Q2.D 87,40.64 88.27,41.91 D3.A 93.34,44.45 94.61,43.18
M2
  Bottom 1.27: Q1.D 87,54.61 88.27,55.88 D4.A 93.31,58.42 X5.2
MAX7219CLK
  Top 0.406: SV2.8 28.09,71.75 26.75,70.41 26.75,60.68 39.8,47.62 54.61,47.62 55.08,47.16 SOCKET_IN.5
  Bottom 0.406: SV1.3 47.62,39.19 48.05,38.76 50.8,38.76 51.41,39.37 51.41,43.16 52.07,43.81 53.17,43.81 SOCKET_IN.5
MAX7219CS
  Top 0.406: SV2.9 28.57,69.22 27.31,67.95 27.31,60.96 40.08,48.18 54.96,48.18 56.2,46.95 56.2,44.49 55.54,43.84 53.37,43.84 53.34,43.81 52.54,44.62 SOCKET_IN.4
  Bottom 0.406: SV1.7 57.72,41.34 57.72,45.42 55.54,47.6 52.71,47.6 52.54,47.43 SOCKET_IN.4
MAX7219DIN
  Top 0.406: SV2.7 27.3,74.3 26.05,73.03 26.05,60.59 42.9,43.74 49.4,43.74 50,44.34 SOCKET_IN.3
  Bottom 0.406: SV1.4 50,41.44 SOCKET_IN.3
MM01
  Top 0.406: Q2.G R2.2 80.59,43.55 80.59,42.17 78.42,40.01 R1.1
MM92
  Top 0.406: R5.1 78.42,53.34 80.59,55.5 80.59,56.89 R6.2 Q1.G
MOSFET01
  Top 0.406: R2.1 76.83,44.77 76.83,58.42 78.74,60.33 78.74,81.92 76.2,84.45 J1.10
MOSFET02
  Top 0.406: R6.1 79.38,59.38 79.38,82.55 74.93,87 J1.11
N$5
  Top 0.406: IC2.3 88.9,19.05 89.53,19.68 89.53,23.5 90.17,24.13 91.44,25.4 94.61,25.4 X7.1
N$6
  Top 0.406: IC2.6 88.9,26.67 89.53,27.3 93.34,27.3 94.61,28.57 94.58,30.48 X7.2
N$8
  Top 0.152: R3.1
  Top 0.406: C3.- 93.39,78.7 93.03,79.06 R3.1
N$9
  Top 0.406: LED_01.C R4.2
N$11
  Top 0.406: X6.2 94.66,19.05 97.16,19.05 98.42,17.78 98.42,11.43 97.16,10.16 84.45,10.16 82.55,12.06 82.55,17.78 82.55,18.41 81.92,19.05 IC2.14
N$12
  Top 0.406: X6.1 94.58,13.93 91.44,13.97 89.53,12.06 85.09,12.06 83.19,13.97 83.19,25.4 81.92,26.67 IC2.11
N$16
  Top 0.406: JP3.5 R10.1
N$17
  Top 0.406: JP3.3 R9.1
N$18
  Top 0.406: JP3.1 R11.1
N$19
  Top 1.016: IC1.1 87.98,92.43 88.65,93.09 EXT_5V1.2
N$20
  Top 0.406: J8.3 15.88,67.31 14.61,66.04 IC4.5
N$23
  Bottom 0.813: J2.4 TEENSY3.2.23/A9
N$25
  Top 1.27: IC1.2 87.95,96.54 87.64,97.16 76.33,97.16 EXT_5V.1 74.3,92.71 79.38,87.63 C2.+
N$26
  Bottom 0.813: J2.5 TEENSY3.2.22/A8
N$27
  Bottom 0.813: J2.6 TEENSY3.2.21/A7
N$28
  Bottom 0.813: J2.7 TEENSY3.2.20/A6
N$29
  Bottom 0.813: J2.8 TEENSY3.2.19/A5
N$30
  Bottom 0.813: J2.9 TEENSY3.2.18/A4
N$31
  Bottom 0.813: J2.10 TEENSY3.2.17/A3
N$32
  Bottom 0.813: J2.11 TEENSY3.2.16/A2
N$33
  Bottom 0.813: J2.12 TEENSY3.2.15/A1
N$34
  Bottom 0.813: J2.13 TEENSY3.2.14/A0
N$35
  Bottom 0.813: J2.14 TEENSY3.2.13
N$36
  Bottom 0.813: TEENSY3.2.12 J9.1
N$37
  Bottom 0.813: TEENSY3.2.11 J9.2
N$38
  Bottom 0.813: TEENSY3.2.10 J9.3
N$39
  Bottom 0.813: TEENSY3.2.9 J9.4
N$40
  Bottom 0.813: TEENSY3.2.8 J9.5
N$41
  Bottom 0.813: TEENSY3.2.7 J9.6
N$55
  Bottom 0.813: TEENSY3.2.RESET/DAC 55.61,59.69 58.8,56.5 14/DAC.1
N$57
  Top 0.406: JP4.2 19.68,43.18 19.68,28.19 19.94,27.94 DRV8825.M2
N$58
  Top 0.406: JP5.2 19.05,43.18 19.05,27.94 21.59,25.4 DRV8825.M1
N$59
  Top 0.406: DRV8825.M0 23.24,22.86 18.41,27.69 18.41,38.1 15.24,41.27 15.24,42.55 STP_CONF.2
N$61
  Bottom 0.813: TEENSY3.2.1 J9.12
N$62
  Bottom 0.813: TEENSY3.2.0 J9.13
N$63
  Top 0.406: R15.A 3.81,60.33 2.54,59.05 2.54,55.88 3.81,54.61 10.16,54.61 11.43,55.88 11.43,57.15 12.45,58.17 17.53,58.17 20.95,61.59 20.95,63.5 | R16.1 21.27,64.45 20.95,64.14 20.95,63.5 | IC4.2 20.95,63.5
N$64
  Top 0.61: R14.2 11.96,3.5 LED_02.C
N$66
  Top 0.406: C8.+ 13.45,81.17 J7.2
N$67
  Top 0.406: R17.A R17.S 6.35,71.12 10.16,74.93 R18.2
N$68
  Top 0.406: IC5.3 3.17,85.09 3.81,84.45 6.04,84.45 6.99,85.41 C4.1 9.21,85.41 10.16,84.45 R18.1
N$69
  Top 0.406: R19.E 5.08,91.44 4.45,90.81 IC5.2 IC5.1
N$70
  Top 0.406: J8.2 18.41,69.06 15.24,65.89 15.24,65.41 14.61,64.77 IC4.6
N$71  (via drill 0.35)
  Top 0.406: IC5.5 v1.91,83.82
  Bottom 0.406: v1.91,83.82 2.54,84.45 8.89,84.45 11.43,87 11.43,92.71 10.16,93.98 R19.S
N$72  (via drill 0.35)
  Top 0.406: IC5.6 IC5.7 4.45,81.28 1.91,78.74 1.91,74.3 3.17,73.03 v6.99,73.03 | C9.- C8.- 12.7,74.93 v10.79,73.03
  Bottom 0.406: v6.99,73.03 v10.79,73.03
N$73
  Top 0.61: J7.3 20.84,81.17 C9.+
N$75  (via drill 0.35)
  Top 0.406: IC4.7 v14.61,63.5
  Bottom 0.406: v14.61,63.5 15.88,63.5 16.71,64.33 16.71,66.87 17.78,67.94 20.32,67.94 20.95,68.58 J8.1
N$76
  Top 0.61: R20.2 18.32,3.4 LED_03.C
OLEDDC
  Top 0.406: SV2.10 29.14,66.67 27.86,65.41 27.86,61.19 40.24,48.82 55.11,48.82 56.94,46.99 56.94,44.24 55.24,42.55 SV1.6
OLEDRES
  Top 0.406: SV1.5 52.7,38.93 52.88,38.76 58.25,38.76 59.41,39.92 59.41,45.32 55.32,49.4 40.49,49.4 39.87,50.03 28.42,61.47 28.42,62.71 29.84,64.14 SV2.11
OPAMPIN  (via drill 0.35)
  Top 0.406: IC4.3 16.61,64.77 v15.97,65.41
  Bottom 0.406: v15.97,65.41 15.97,67.82 13.94,69.85 J8.4
OPAMPOUT  (via drill 0.35)
  Top 0.406: R15.S R15.E | v15.24,62.23 IC4.1 v19.68,62.23
  Bottom 0.406: R15.E 10.16,62.23 v15.24,62.23 | v19.68,62.23 22.86,62.23 24.77,60.33 24.77,52.07 27.3,49.53 69.22,49.53 76.83,57.15 76.83,75.56 70.94,81.92 J1.9
PIN2
  Bottom 0.813: TEENSY3.2.2 J9.11
PIN3
  Bottom 0.813: TEENSY3.2.3 J9.10
PIN4
  Bottom 0.813: TEENSY3.2.4 J9.9
PIN5
  Bottom 0.813: TEENSY3.2.5 J9.8
PIN6
  Bottom 0.813: TEENSY3.2.6 J9.7
POT01  (via drill 0.35)
  Top 0.406: R7.3 22.86,2.54 23.5,1.91 27.94,1.91 29.79,1.96 66.67,1.96 68.58,3.86 68.58,27.3 v68.48,29.21 | v68.48,45.09 68.48,52.61 v69.22,53.34
  Bottom 0.406: v68.48,29.21 68.48,44.99 68.58,45.09 v68.48,45.09 | v69.22,53.34 74.3,58.42 74.3,71.12 71.12,74.3 J1.6
POT02  (via drill 0.35)
  Top 0.406: v69.22,46.35 v69.22,52.07
  Bottom 0.406: R8.3 69.22,15.88 v69.22,46.35 | v69.22,52.07 74.93,57.78 74.93,73.03 71.12,76.83 J1.7
SENSORPORT  (via drill 0.35)
  Top 0.406: R10.2 13.62,52.11 X8.2 | R10.2 R9.2 R11.2 | v25.78,52.45 25.78,51.18 24.13,49.53 15.56,49.53 14.29,50.8 R10.2
  Bottom 0.406: J1.8 71.12,79.38 76.2,73.87 76.2,57.78 68.83,50.42 27.3,50.42 25.78,51.94 v25.78,52.45
V+
  Top 0.152: 94.58,83.19 X1.1
  Top 1.016: 91.19,84.07 91.44,83.82 | EXT_5V1.1 92.96,95.63 93.34,95.25 93.34,91.44 93.09,91.19
  Top 1.27: 91.44,83.82 92.08,83.19 94.58,83.19 | C1.+ 89.65,88.38 | 89.65,88.38 91.19,86.84 91.19,84.07 | 89.65,88.38 90.28,88.38 93.09,91.19
  Bottom 0.152: 94.66,83.19 X1.1 | 94.66,52.07 X5.1 | 97.9,38.14 97.94,38.1
  Bottom 1.27: 97.94,52.07 97.94,38.1 97.94,34.29 | 97.94,34.29 97.94,8.89 90.81,1.75 27.94,1.75 26.67,3.02 26.67,15.24 24.77,17.14 JP1.1 | IC2.8 87,33.66 87.63,34.29 97.94,34.29 | C3.+ 97.94,75.29 | 97.94,75.29 97.94,52.07 | 97.94,75.29 97.94,83.19 94.66,83.19 | 97.94,52.07 94.66,52.07 93.39,50.8 D4.C | D3.C 93.31,36.83 X4.1 97.9,38.14
VMOT
  Top 1.016: C7.+ 15.88,15.88 17.14,14.61 19.68,14.61 20.32,15.24 JP1.2
  Bottom 1.016: DRV8825.VMOT 13.97,19.05 C7.+
  Bottom 1.27: X3.1 6.96,15.86 6.99,15.88 C7.+

### Text on the board
Top: BLINK. / SENSE. / MOVE.
tNames: R4 | LED 01 | IC1 | J7 | MCU1 | TEENSY 3.2 | GND | VIN | 00 | AGND | X1 | 01 | 3.3V | R19 | BUT 01 | 02 | 23/A9 | ~ | MOSFET 02 | C2 | C1 | IC5 | C4 | BUT 02 | 03 ~ | 22/A8 | ~ | MOSFET 01 | R3 | C8 | C9 | HB EN | 04 ~ | 21/A7 | ~ | OPAMP OUT | C10 | R18 | HB IN 01 | 05 ~ | 20/A6 | ~ | SENSORPORT | HB IN 02 | 06 ~ | 19/A5 | POT 02 | C3 | C3 | DIS DIN | 07 | 18/A4 | POT 01 | OIN | +IN | -IN | OOUT | DIS CLK | 08 | 17/A3 | STP EN | R17 | JLCJLCJLCJLC | DIS CS | 09 ~ | 16/A2 | STP RST | IC4 | 10 ~ | 15/A1 | STP SLP | R15 | 11 | 14/A0 | STP STP | R16 | 12 | 13/LED | STP DIR | Q1 | D4 | X8 | X5 | JP3 | A14/DAC | R11 | 10k | AUDIO_OUT | R9 | 1M | R10 | 10M | STP CONF | X8 | DISPLAY 01 | STP HIGH | MAX7219 | Q2 | D3 | X4 | R2 | STP LOW | X2 | DRV8825 | R1 | IC2 | H-Bridge | X7 | JP4 | HB 02 | HB EN | HB IN 02 | HB IN 01 | C7 | JP1 | EX | 5V | EXT | BUT 01 | BUT 02 | X6 | X3 | digital media / hfk bremen v0.2 | POT 01 | POT 02
bNames: GND | POWER IN | + (with jumper 7-12V, without 5V) | 5V | SENSORPORT | MOSFET 02 OUT | GND | MOSFET 01 OUT | A2 | A1 | DRV8825 OUT | B1 | HB 02 OUT | B2 | + | HB 01 OUT | DRV8825 VIN | GND
tStop: BLINK. / SENSE. / MOVE.